# Altium schematic sheet connectors.SchDoc: Connectors
size A4; Date: 30.05.2015; Author: Michał Gumiela; DocumentNumber: 8; SheetNumber: 8; SheetTotal: 9; Model: EM1; PageSetup: Record=PageOptions|CenterHorizontal=True|CenterVertical=True|PrintScale=0.52|XCorrection=1.00|YCorrection=1.00|PrintKind=1|BorderSize=5000000|LeftOffset=0|BottomOffset=0|Orientation=2|PaperLength=4200|PaperWidth=2970|Scale=100|PaperSource=7|PrintQuality=600|MediaType=1|DitherType=10|PaperKind=A3|PrintScaleMode=1
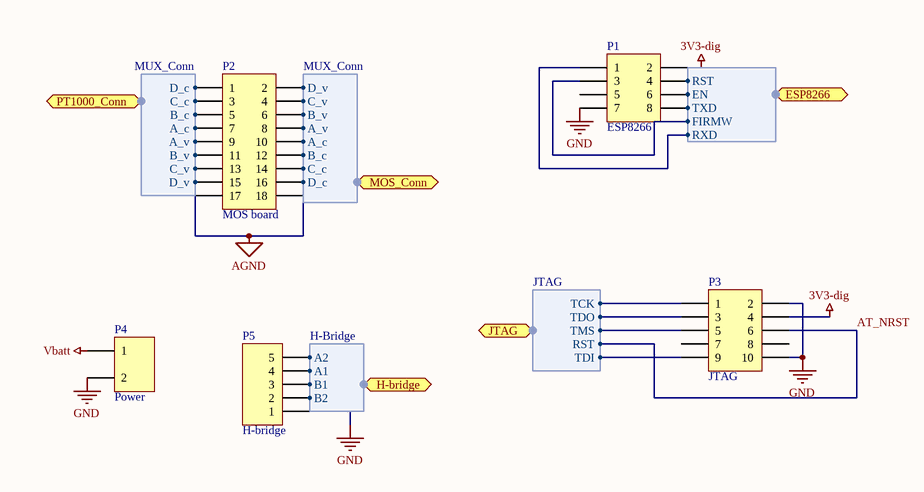
[diagram p0: connectors.SchDoc]

## Parts
P1  ESP8266  [Header 2x4]
P2  MOS board  [Header 2x9]
P3  JTAG  [Header 2x5]
P4  Power  [Header 1x3]
P5  H-bridge  [Header 1x5]

## Ports
ESP8266 (harness ESP8266), H-bridge (harness H-Bridge), JTAG (harness JTAG), MOS_Conn (harness MUX_Conn), PT1000_Conn (harness MUX_Conn)

## Harnesses
ESP8266: TXD, RXD, EN, RST, FIRMW
H-Bridge: A1, A2, B1, B2
MUX_Conn: A_c, B_c, C_c, D_c, A_v, B_v, C_v, D_v
JTAG: TCK, TMS, TDO, TDI, RST

## Nets
3V3-dig: P1.2 P3.4
AGND: P2.17 P2.18
GND: P1.7 P3.2 P3.10 P4.3(2) P5.1
Vbatt: P4.1
AT_NRST: P3.6 ; port JTAG.RST
NetP1_1: P1.1 ; port ESP8266.RXD
NetP1_3: P1.3 ; port ESP8266.FIRMW
NetP1_4: P1.4 ; port ESP8266.RST
NetP1_6: P1.6 ; port ESP8266.EN
NetP1_8: P1.8 ; port ESP8266.TXD
NetP2_1: P2.1 ; port PT1000_Conn.D_c
NetP2_2: P2.2 ; port MOS_Conn.D_v
NetP2_3: P2.3 ; port PT1000_Conn.C_c
NetP2_4: P2.4 ; port MOS_Conn.C_v
NetP2_5: P2.5 ; port PT1000_Conn.B_c
NetP2_6: P2.6 ; port MOS_Conn.B_v
NetP2_7: P2.7 ; port PT1000_Conn.A_c
NetP2_8: P2.8 ; port MOS_Conn.A_v
NetP2_9: P2.9 ; port PT1000_Conn.A_v
NetP2_10: P2.10 ; port MOS_Conn.A_c
NetP2_11: P2.11 ; port PT1000_Conn.B_v
NetP2_12: P2.12 ; port MOS_Conn.B_c
NetP2_13: P2.13 ; port PT1000_Conn.C_v
NetP2_14: P2.14 ; port MOS_Conn.C_c
NetP2_15: P2.15 ; port PT1000_Conn.D_v
NetP2_16: P2.16 ; port MOS_Conn.D_c
NetP3_1: P3.1 ; port JTAG.TCK
NetP3_3: P3.3 ; port JTAG.TDO
NetP3_5: P3.5 ; port JTAG.TMS
NetP3_9: P3.9 ; port JTAG.TDI
NetP5_2: P5.2 ; port H-bridge.B2
NetP5_3: P5.3 ; port H-bridge.B1
NetP5_4: P5.4 ; port H-bridge.A1
NetP5_5: P5.5 ; port H-bridge.A2

Not connected (* = marked no-connect by the designer): P1 5; P3 7 8; P4 2

## Notes on the sheet
- Title:
- Sheet:
- of
- Author:
- Model:
- Document Number:
- Checked by:
- Iss-Rev:
- Approved by:
- Date:
- File name:

## Library data of the parts
P1 = Header 4X2: Header, 4-Pin, Dual row; LatestRevisionDate: 17-Jul-2002; LatestRevisionNote: Re-released for DXP Platform.; Publisher: Altium Limited
P2 = Header 9X2: Header, 9-Pin, Dual row; LatestRevisionDate: 17-Jul-2002; LatestRevisionNote: Re-released for DXP Platform.; Publisher: Altium Limited
P3 = Header 5X2: Header, 5-Pin, Dual row; LatestRevisionDate: 17-Jul-2002; LatestRevisionNote: Re-released for DXP Platform.; Publisher: Altium Limited
P4 = Header 3: Header, 3-Pin; LatestRevisionDate: 17-Jul-2002; LatestRevisionNote: Re-released for DXP Platform.; Publisher: Altium Limited
P5 = Header 5: Header, 5-Pin; LatestRevisionDate: 17-Jul-2002; LatestRevisionNote: Re-released for DXP Platform.; Publisher: Altium Limited